# EAGLE schematic RemoteSensor_lpc824 (EAGLE 7.3.0)
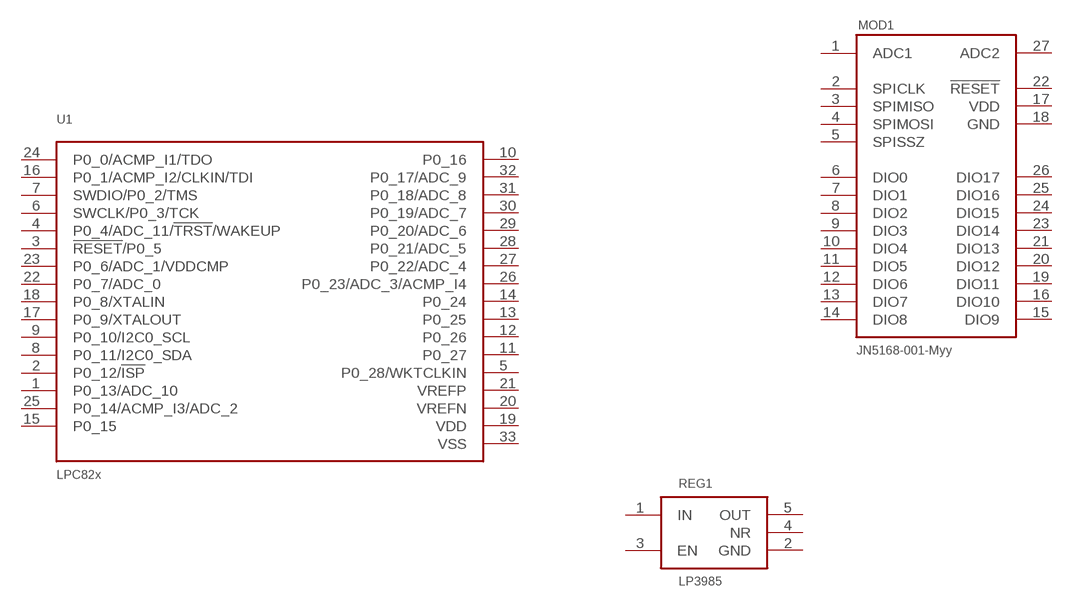
[diagram p0: schematic, sheet 1]

## Parts
MOD1  JN5168-001-M00  [JN5168-001-M00]
REG1  LP3985DBV  [SOT23]
U1  LPC82XMX01JHI33  [QFN33]
Unconnected: MOD1.1(ADC1) MOD1.2(SPICLK) MOD1.3(SPIMISO) MOD1.4(SPIMOSI) MOD1.5(SPISSZ) MOD1.6(DIO0) MOD1.7(DIO1) MOD1.8(DIO2) MOD1.9(DIO3) MOD1.10(DIO4) MOD1.11(DIO5) MOD1.12(DIO6) MOD1.13(DIO7) MOD1.14(DIO8) MOD1.15(DIO9) MOD1.16(DIO10) MOD1.19(DIO11) MOD1.20(DIO12) MOD1.21(DIO13) MOD1.22(!RESET) MOD1.23(DIO14) MOD1.24(DIO15) MOD1.25(DIO16) MOD1.26(DIO17) MOD1.27(ADC2) REG1.3(EN) REG1.4(NR) U1.1(P0_13/ADC_10) U1.2(P0_12/!ISP!) U1.3(!RESET!/P0_5) U1.4(P0_4/ADC_11/!TRST!/WAKEUP) U1.5(P0_28/WKTCLKIN) U1.6(SWCLK/P0_3/TCK) U1.7(SWDIO/P0_2/TMS) U1.8(P0_11/I2C0_SDA) U1.9(P0_10/I2C0_SCL) U1.10(P0_16) U1.11(P0_27) U1.12(P0_26) U1.13(P0_25) U1.14(P0_24) U1.15(P0_15) U1.16(P0_1/ACMP_I2/CLKIN/TDI) U1.17(P0_9/XTALOUT) U1.18(P0_8/XTALIN) U1.22(P0_7/ADC_0) U1.23(P0_6/ADC_1/VDDCMP) U1.24(P0_0/ACMP_I1/TDO) U1.25(P0_14/ACMP_I3/ADC_2) U1.26(P0_23/ADC_3/ACMP_I4) U1.27(P0_22/ADC_4) U1.28(P0_21/ADC_5) U1.29(P0_20/ADC_6) U1.30(P0_19/ADC_7) U1.31(P0_18/ADC_8) U1.32(P0_17/ADC_9)

## Power pins joined to a net without a drawn wire
GND: MOD1.18(GND) REG1.2(GND)
IN: REG1.1(IN)
OUT: REG1.5(OUT)
VDD: MOD1.17(VDD) U1.19(VDD)
VREFN: U1.20(VREFN)
VREFP: U1.21(VREFP)
VSS: U1.33(VSS)

## Library data of the parts
MOD1 = heck:JN5168-001-M: The JN5168-001-Myy family is a range of ultra low power, high performance surface mount modules targeted at IEEE 802.15.4, JenNet-IP, ZigBee Light Link, ZigBee Smart Energy and RF4CE networking applications, enabling users to realise products with minimum time to market and at the lowest cost. They remove the need for expensive and lengthy development of custom RF board designs and test suites. The modules use NXP’s JN5168 wireless microcontroller to provide a comprehensive solution with large memory, high CPU and radio performance and all RF components included. All that is required to develop and manufacture wireless control or sensing products is to connect a power supply and peripherals such as switches, actuators and sensors, considerably simplifying product development. Four module variants are available: JN5168-001-M00 with an integrated antenna, JN5168-001-M03 with an antenna connector and the JN5168-001-M05 and M06 with an antenna connector, power amplifier and LNA for extended range. The JN5168-001-M05 output power has been optimised for use in Europe and Asia.
REG1 = heck:LP3985: Ultra Low-Dropout CMOS Voltage regulator. 150mA Load, available in fixed voltages: 2.5-V, 2.6-V, 2.7-V, 2.8-V, 2.85-V, 2.9-V, 3-V, 3.1V, 3.2-V, 3.3-V, 4.7-V, 4.75-V, 4.8-V and 5-V
U1 = heck:LPC82XMX01JHI33: LPC824M201JHI33 - 32KB flash, 8KB SRAM LPC822M101JHI33 - 16KB flash, 4KB SRAM